# EAGLE schematic j&h (EAGLE 8.2.0)
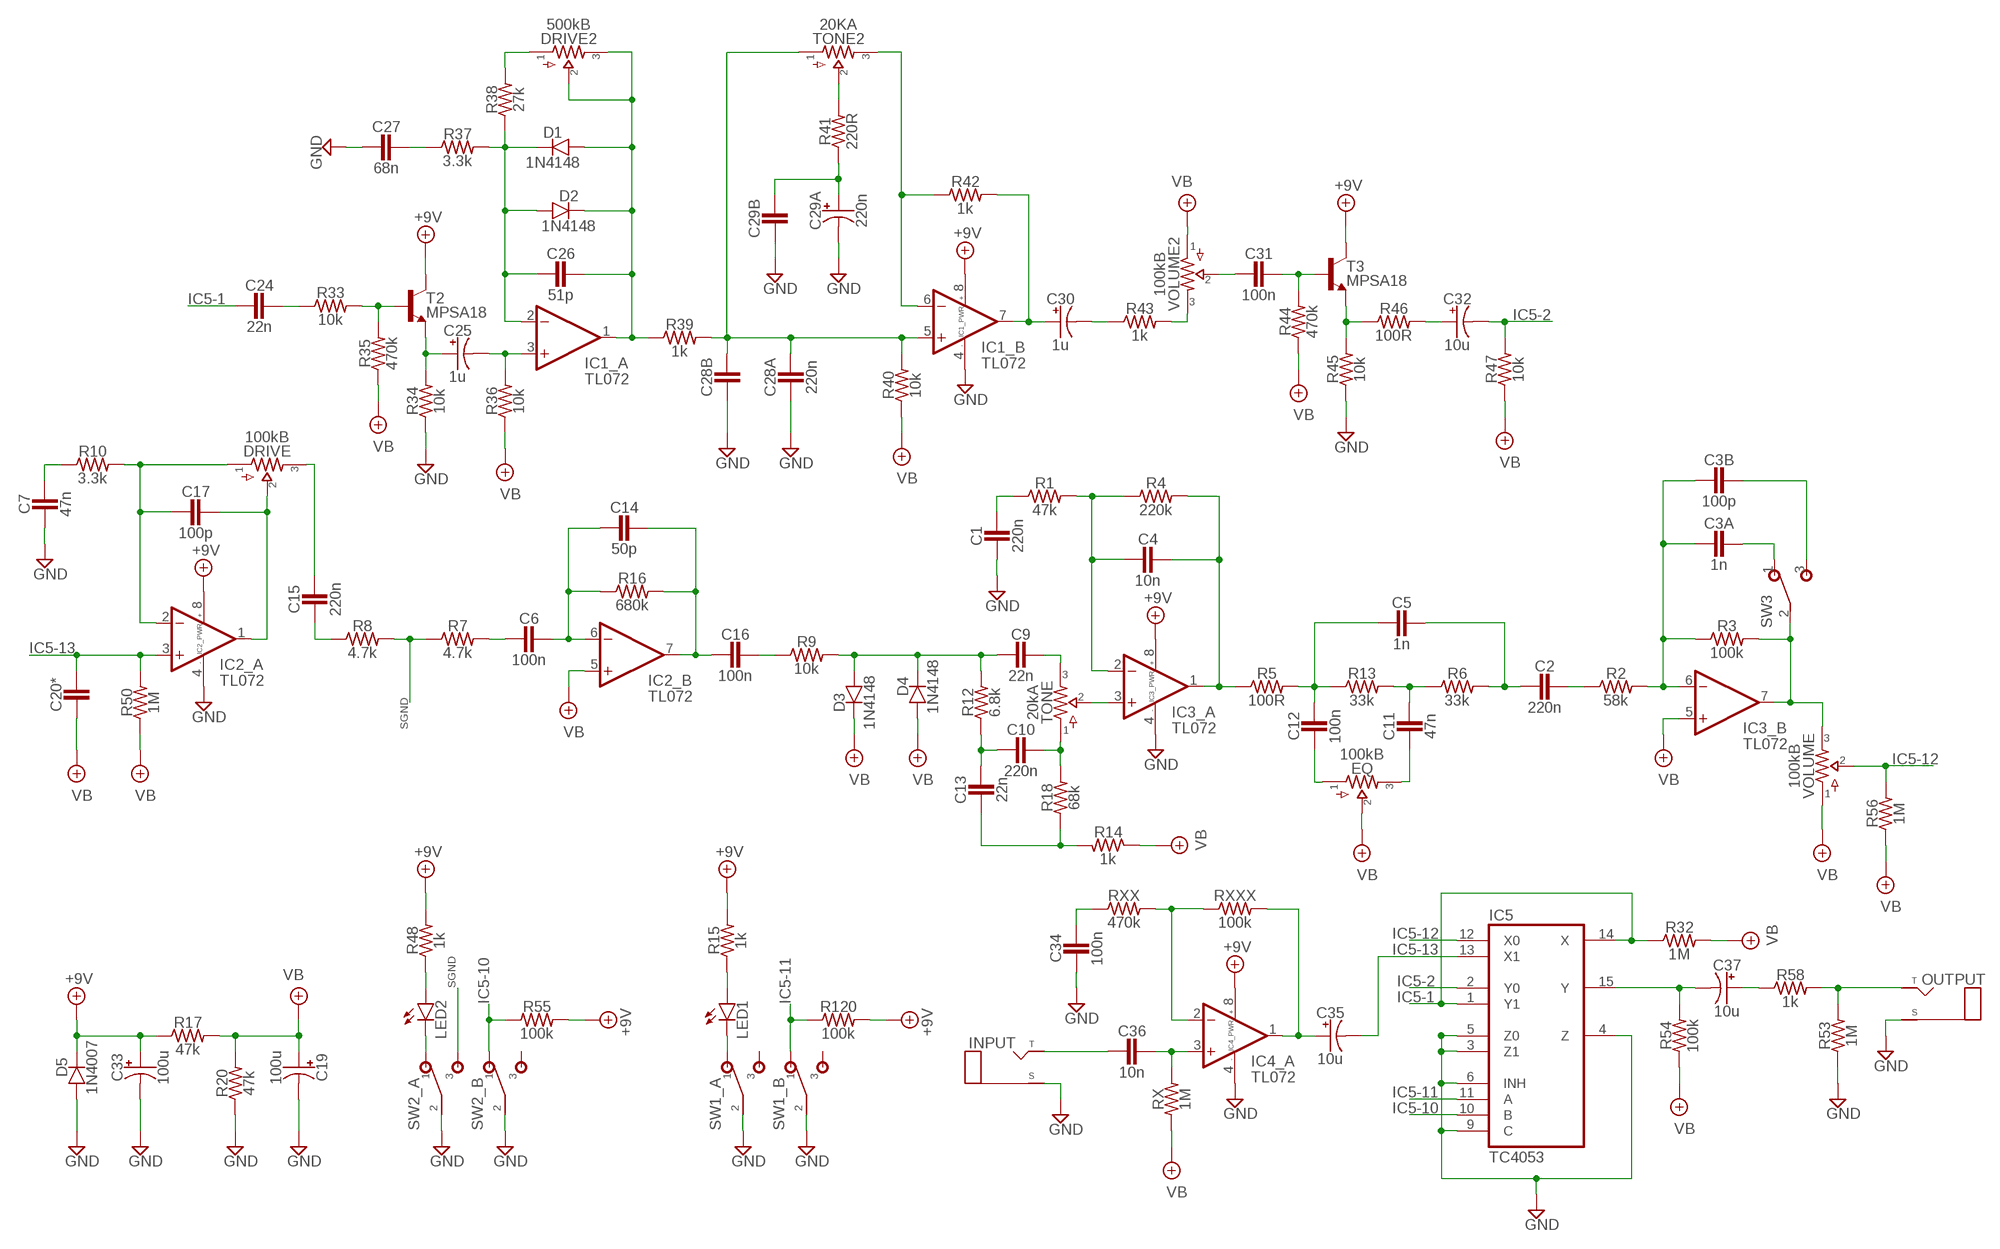
[diagram p0: schematic, sheet 1]

## Parts
C1  220n  CER/FILMBOX.1  [BOX_SMALL]
C2  220n  CER/FILMBOX.1  [BOX_SMALL]
C3A  1n  CER/FILMBOX.1  [BOX_SMALL]
C3B  100p  CER/FILMBOX.1  [BOX_SMALL]
C4  10n  CER/FILMBOX.1  [BOX_SMALL]
C5  1n  CER/FILMBOX.1  [BOX_SMALL]
C6  100n  CER/FILMBOX.1  [BOX_SMALL]
C7  47n  CER/FILMBOX.1  [BOX_SMALL]
C9  22n  CER/FILMBOX.1  [BOX_SMALL]
C10  220n  CER/FILMBOX.1  [BOX_SMALL]
C11  47n  CER/FILMBOX.1  [BOX_SMALL]
C12  100n  CER/FILMBOX.1  [BOX_SMALL]
C13  22n  CER/FILMBOX.1  [BOX_SMALL]
C14  50p  CER/FILMBOX.1  [BOX_SMALL]
C15  220n  CER/FILMBOX.1  [BOX_SMALL]
C16  100n  CER/FILMBOX.1  [BOX_SMALL]
C17  100p  CER/FILMBOX.1  [BOX_SMALL]
C19  100u  0501  [050_020_1]
C20*  CER/FILMBOX.1  [BOX_SMALL]
C24  22n  CER/FILMBOX.1  [BOX_SMALL]
C25  1u  0501  [050_020_1]
C26  51p  CER/FILMBOX.1  [BOX_SMALL]
C27  68n  CER/FILMBOX.1  [BOX_SMALL]
C28A  220n  CER/FILMBOX.1  [BOX_SMALL]
C28B  CER/FILMBOX.1  [BOX_SMALL]
C29A  220n  0501  [050_020_1]
C29B  CER/FILMBOX.1  [BOX_SMALL]
C30  1u  0501  [050_020_1]
C31  100n  CER/FILMBOX.1  [BOX_SMALL]
C32  10u  0501  [050_020_1]
C33  100u  0501  [050_020_1]
C34  100n  CER/FILMBOX.1  [BOX_SMALL]
C35  10u  0501  [050_020_1]
C36  10n  CER/FILMBOX.1  [BOX_SMALL]
C37  10u  0501  [050_020_1]
D1  1N4148  DO41.2  [DO41-2]
D2  1N4148  DO41.2  [DO41-2]
D3  1N4148  DO41.2  [DO41-2]
D4  1N4148  DO41.2  [DO41-2]
D5  1N4007  DO41.2  [DO41-2]
DRIVE  100kB  POTS16MM  [16MM]
DRIVE2  500kB  POTS16MM  [16MM]
EQ  100kB  POTS16MM  [16MM]
IC1  TL072  DUALTH  [DIL0]
IC2  TL072  DUALTH  [DIL0]
IC3  TL072  DUALTH  [DIL0]
IC4  TL072  DUALTH  [DIL0]
IC5  TC4053  4053N  [DIL16]
INPUT  MONO  [TWO_PADS]
LED1  LED  [3MM_D]
LED2  LED  [3MM_D]
OUTPUT  MONO  [TWO_PADS]
R1  47k  R_.3B  [R0207/3]
R2  58k  R_.3B  [R0207/3]
R3  100k  R_.3B  [R0207/3]
R4  220k  R_.3B  [R0207/3]
R5  100R  R_.3B  [R0207/3]
R6  33k  R_.3B  [R0207/3]
R7  4.7k  R_.3B  [R0207/3]
R8  4.7k  R_.3B  [R0207/3]
R9  10k  R_.3B  [R0207/3]
R10  3.3k  R_.3B  [R0207/3]
R12  6.8k  R_.3B  [R0207/3]
R13  33k  R_.3B  [R0207/3]
R14  1k  R_.3B  [R0207/3]
R15  1k  R_.3B  [R0207/3]
R16  680k  R_.3B  [R0207/3]
R17  47k  R_.3B  [R0207/3]
R18  68k  R_.3B  [R0207/3]
R20  47k  R_.3B  [R0207/3]
R32  1M  R_.3B  [R0207/3]
R33  10k  R_.3B  [R0207/3]
R34  10k  R_.3B  [R0207/3]
R35  470k  R_.3B  [R0207/3]
R36  10k  R_.3B  [R0207/3]
R37  3.3k  R_.3B  [R0207/3]
R38  27k  R_.3B  [R0207/3]
R39  1k  R_.3B  [R0207/3]
R40  10k  R_.3B  [R0207/3]
R41  220R  R_.3B  [R0207/3]
R42  1k  R_.3B  [R0207/3]
R43  1k  R_.3B  [R0207/3]
R44  470k  R_.3B  [R0207/3]
R45  10k  R_.3B  [R0207/3]
R46  100R  R_.3B  [R0207/3]
R47  10k  R_.3B  [R0207/3]
R48  1k  R_.3B  [R0207/3]
R50  1M  R_.3B  [R0207/3]
R53  1M  R_.3B  [R0207/3]
R54  100k  R_.3B  [R0207/3]
R55  100k  R_.3B  [R0207/3]
R56  1M  R_.3B  [R0207/3]
R58  1k  R_.3B  [R0207/3]
R120  100k  R_.3B  [R0207/3]
RX  1M  R_.3B  [R0207/3]
RXX  470k  R_.3B  [R0207/3]
RXXX  100k  R_.3B  [R0207/3]
SW1  DPDT  [DPDT]
SW2  DPDT  [DPDT]
SW3  SPDT  [M9040P]
T2  MPSA18  2N3904  [TO92-]
T3  MPSA18  2N3904  [TO92-]
TONE  20kA  POTS16MM  [16MM]
TONE2  20KA  POTS16MM  [16MM]
VOLUME  100kB  POTS16MM  [16MM]
VOLUME2  100kB  POTS16MM  [16MM]

## Nets
+9V: C33.+ D5.C IC1.8(_PWR:V+) IC2.8(_PWR:V+) IC3.8(_PWR:V+) IC4.8(_PWR:V+) R15.2 R17.1 R48.2 R55.2 R120.2 T2.1(C) T3.1(C)
GND: C1.2 C7.2 C19.- C27.2 C28A.2 C28B.2 C29A.- C29B.2 C33.- C34.2 D5.A IC1.4(_PWR:V-) IC2.4(_PWR:V-) IC3.4(_PWR:V-) IC4.4(_PWR:V-) IC5.3(Z1) IC5.4(Z) IC5.5(Z0) IC5.6(INH) IC5.9(C) INPUT.S(SLEEVE) OUTPUT.S(SLEEVE) R20.1 R34.1 R45.1 R53.1 SW1.A2 SW1.B2 SW2.A2 SW2.B2
IC5-1: C24.2 IC5.1(Y1) IC5.14(X) R32.1
IC5-2: C32.- IC5.2(Y0) R47.2
IC5-10: IC5.10(B) R55.1 SW2.B1
IC5-11: IC5.11(A) R120.1 SW1.B1
IC5-12: IC5.12(X0) R56.2 VOLUME.2
IC5-13: C20*.1 C35.- IC2.3(_A:+IN) IC5.13(X1) R50.2
N$1: C14.1 C16.2 IC2.7(_B:OUT) R16.2
N$2: C34.1 RXX.1
N$3: C17.1 DRIVE.2 IC2.1(_A:OUT)
N$4: C17.2 DRIVE.1 IC2.2(_A:-IN) R10.2
N$5: C7.1 R10.1
N$6: C15.1 DRIVE.3
N$7: C15.2 R8.1
N$9: C6.2 R7.2
N$10: C6.1 C14.2 IC2.6(_B:-IN) R16.1
N$11: C16.1 R9.1
N$12: C9.2 D3.A D4.C R9.2 R12.2
N$13: C9.1 TONE.3
N$14: C10.1 R18.2 TONE.1
N$15: C10.2 C13.1 R12.1
N$16: C13.2 R14.2 R18.1
N$17: IC3.3(_A:+IN) TONE.2
N$18: C4.2 IC3.2(_A:-IN) R1.2 R4.1
N$19: C4.1 IC3.1(_A:OUT) R4.2 R5.1
N$20: C1.1 R1.1
N$21: C11.2 EQ.3
N$22: C12.2 EQ.1
N$23: C5.2 C12.1 R5.2 R13.1
N$24: C11.1 R6.1 R13.2
N$25: C2.2 C5.1 R6.2
N$26: C2.1 R2.1
N$27: C3A.2 C3B.2 IC3.6(_B:-IN) R2.2 R3.1
N$28: C3B.1 SW3.3(S)
N$29: C3A.1 SW3.1(O)
N$30: IC3.7(_B:OUT) R3.2 SW3.2(P) VOLUME.3
N$32: C26.2 D1.C D2.A IC1.2(_A:-IN) R37.2 R38.1
N$33: DRIVE2.1 R38.2
N$34: C26.1 D1.A D2.C DRIVE2.2 DRIVE2.3 IC1.1(_A:OUT) R39.1
N$36: C24.1 R33.1
N$37: R33.2 R35.2 T2.2(B)
N$38: C25.+ R34.2 T2.3(E)
N$39: C25.- IC1.3(_A:+IN) R36.2
N$40: C27.1 R37.1
N$41: C28A.1 C28B.1 IC1.5(_B:+IN) R39.2 R40.2 TONE2.1
N$42: IC1.6(_B:-IN) R42.1 TONE2.3
N$43: C30.+ IC1.7(_B:OUT) R42.2
N$44: R41.2 TONE2.2
N$45: C29A.+ C29B.1 R41.1
N$46: LED1.ANODE(A) R15.1
N$47: C30.- R43.1
N$48: R43.2 VOLUME2.3
N$49: C31.2 VOLUME2.2
N$50: C31.1 R44.2 T3.2(B)
N$51: R45.2 R46.1 T3.3(E)
N$52: C32.+ R46.2
N$54: LED2.ANODE(A) R48.1
N$55: LED2.P$1(C) SW2.A1
N$56: LED1.P$1(C) SW1.A1
N$57: OUTPUT.T(TIP) R53.2 R58.2
N$58: C37.+ R58.1
N$59: C37.- IC5.15(Y) R54.2
N$60: C35.+ IC4.1(_A:OUT) RXXX.2
N$61: IC4.2(_A:-IN) RXX.2 RXXX.1
N$63: C36.1 IC4.3(_A:+IN) RX.2
N$64: C36.2 INPUT.T(TIP)
SGND: R7.1 R8.2
VB: C19.+ C20*.2 D3.C D4.A EQ.2 IC2.5(_B:+IN) IC3.5(_B:+IN) R14.1 R17.2 R20.2 R32.2 R35.1 R36.1 R40.1 R44.1 R47.1 R50.1 R54.1 R56.1 RX.1 VOLUME2.1 VOLUME.1
Unconnected: IC4.5(_B:+IN) IC4.6(_B:-IN) IC4.7(_B:OUT) SW1.A3 SW1.B3 SW2.A3 SW2.B3

## Power pins joined to a net without a drawn wire
GND: IC5.8(GND)
VCC: IC5.16(VCC)
VEE: IC5.7(VEE)

## Library data of the parts
C1 C2 C3A C3B C4-C7 C9-C17 C20* C24 C26 C27 C28A C28B C29B C31 C34 C36 = pedals-capacitors-film:CER/FILM: 47 - 120pF Xicon Ceramic Disc 2.5mm lead spacing
C19 C25 C29A C30 C32 C33 C35 C37 = pedals-capacitors-elec:050
D1-D5 = pedals-diodes:DO41: DO-41 Package Diodes: 1N4001 - 1N40019 Zener Diodes: 1N4728 - 1N4764
DRIVE DRIVE2 EQ TONE TONE2 VOLUME VOLUME2 = pedals-potentiometers:POTS
IC1-IC4 = pedals-integrated circuits:DUAL: OP AMP
IC5 = 40xx:4053: Triple 2-channel ANALOG MULTIPLEXER
INPUT OUTPUT = pedals-jacks:MONO: Mono 1/4" Phone Jack
LED1 LED2 = pedals-diodes:LED
R1-R10 R12-R18 R20 R32-R48 R50 R53-R56 R58 R120 RX RXX RXXX = pedals-resistors:R_
SW1 SW2 = pedals-switches:DPDT
SW3 = pedals-switches:SPDT: TOGGLE SWITCH Marquardt
T2 T3 = pedals-transistors:2N3904: NPN Transistor